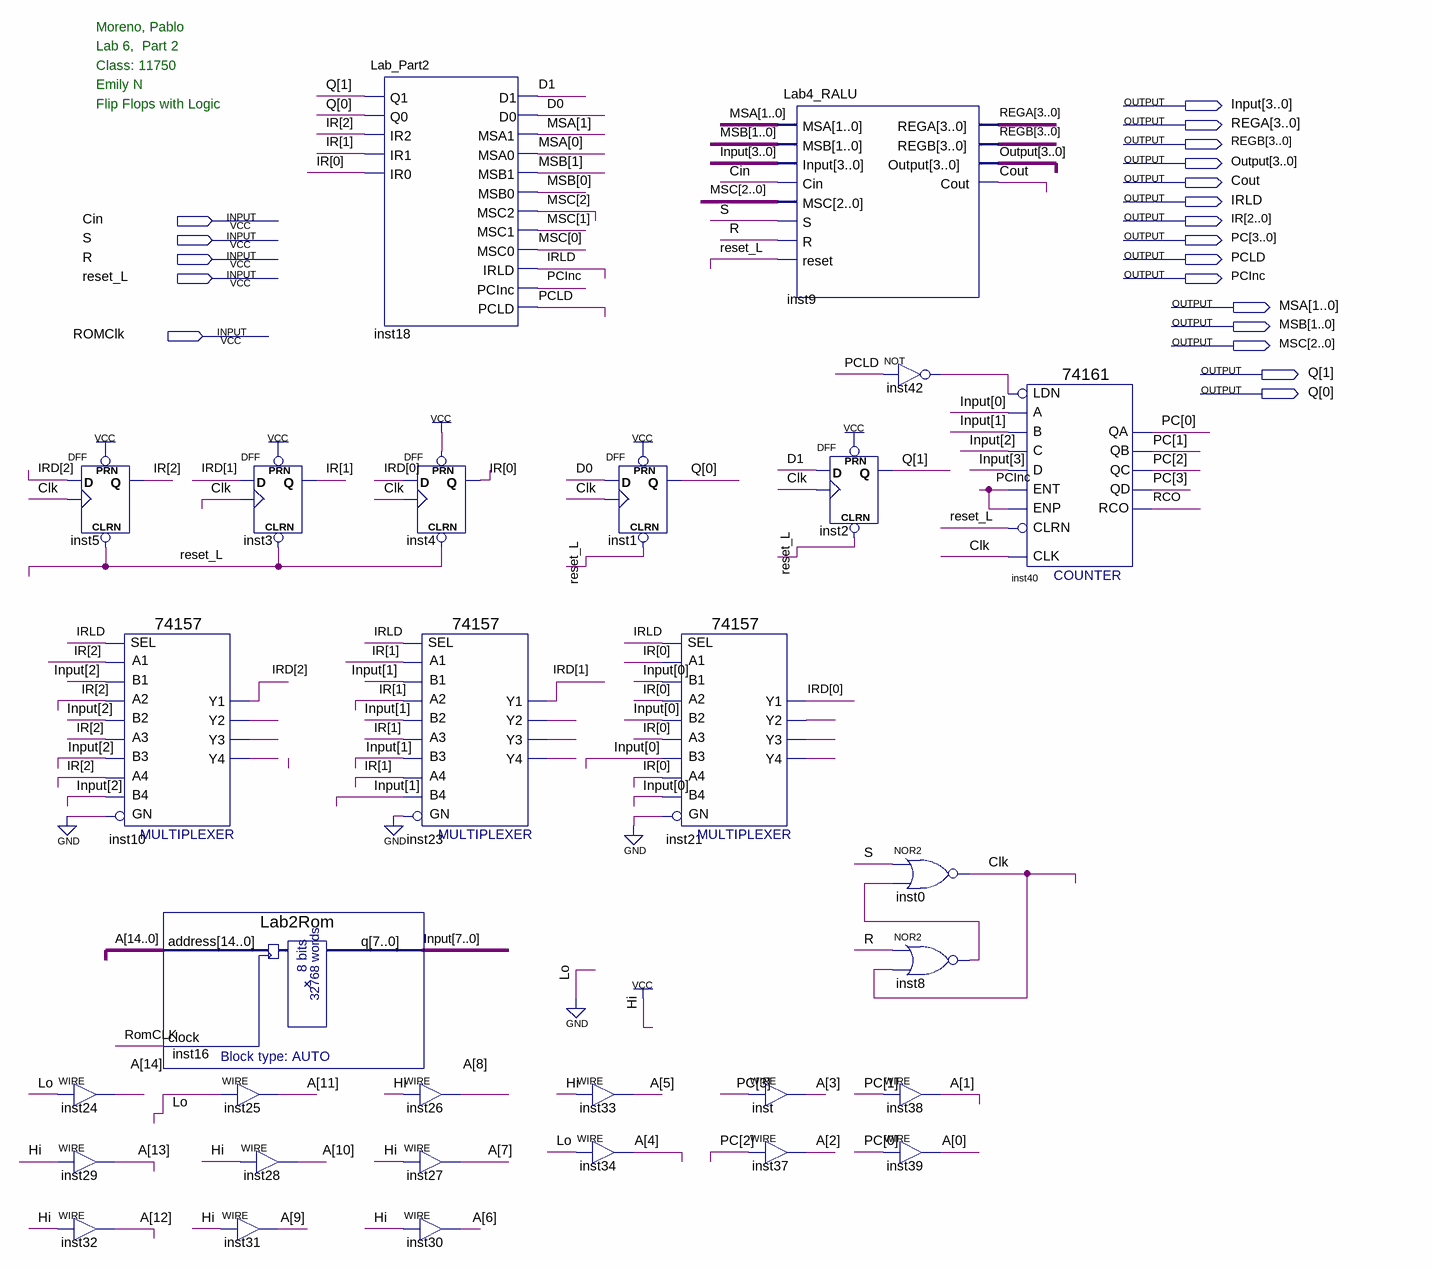
[diagram p0: schematic sheet]
// Quartus schematic Block1.bdf as structural Verilog: 30 symbols, 20 pins
module Block1 (
  input  Cin,
  input  S,
  input  R,
  input  reset_L,
  input  ROMClk,
  output [7:0] Input,
  output [3:0] REGA,
  output [3:0] REGB,
  output [3:0] Output,
  output Cout,
  output IRLD,
  output [2:0] IR,
  output [3:0] PC,
  output PCLD,
  output PCInc,
  output [1:0] MSA,
  output [1:0] MSB,
  output [2:0] MSC,
  output [1:0] Q
);

  wire Clk, D0, D1, inst8_out, inst10_y2, inst10_y3, inst10_y4, inst21_y2, inst21_y3, inst21_y4, inst23_y2,
       inst23_y3, inst23_y4, inst42_out, RCO;
  wire [2:0] IRD;
  wire [14:0] A;

  assign A[14] = 1'b0;  // WIRE inst24
  assign A[13] = 1'b1;  // WIRE inst29
  assign A[12] = 1'b1;  // WIRE inst32
  DFF inst5 (.CLRN(reset_L), .CLK(Clk), .D(IRD[2]), .PRN(1'b1), .Q(IR[2]));
  \74157  inst10 (
    .A1(IR[2]), .B1(Input[2]), .SEL(IRLD), .B2(Input[2]), .A3(IR[2]), .B3(Input[2]), .A2(IR[2]),
    .B4(Input[2]), .GN(1'b0), .A4(IR[2]), .Y2(inst10_y2), .Y1(IRD[2]), .Y4(inst10_y4), .Y3(inst10_y3));
  Lab2Rom inst16 (.address(A), .clock(ROMClk), .q(Input));
  DFF inst3 (.CLRN(reset_L), .CLK(Clk), .D(IRD[1]), .PRN(1'b1), .Q(IR[1]));
  assign A[11] = 1'b0;  // WIRE inst25
  assign A[10] = 1'b1;  // WIRE inst28
  assign A[9] = 1'b1;  // WIRE inst31
  Lab_Part2 inst18 (
    .Q1(Q[1]), .Q0(Q[0]), .IR2(IR[2]), .IR1(IR[1]), .IR0(IR[0]), .D1(D1), .D0(D0), .MSA1(MSA[1]),
    .MSA0(MSA[0]), .MSB1(MSB[1]), .MSB0(MSB[0]), .MSC2(MSC[2]), .MSC1(MSC[1]), .MSC0(MSC[0]), .IRLD(IRLD),
    .PCInc(PCInc), .PCLD(PCLD));
  DFF inst4 (.CLRN(reset_L), .CLK(Clk), .D(IRD[0]), .PRN(1'b1), .Q(IR[0]));
  \74157  inst23 (
    .A1(IR[1]), .B1(Input[1]), .SEL(IRLD), .B2(Input[1]), .A3(IR[1]), .B3(Input[1]), .A2(IR[1]),
    .B4(Input[1]), .GN(1'b0), .A4(IR[1]), .Y2(inst23_y2), .Y1(IRD[1]), .Y4(inst23_y4), .Y3(inst23_y3));
  assign A[8] = 1'b1;  // WIRE inst26
  assign A[7] = 1'b1;  // WIRE inst27
  assign A[6] = 1'b1;  // WIRE inst30
  assign A[5] = 1'b1;  // WIRE inst33
  assign A[4] = 1'b0;  // WIRE inst34
  DFF inst1 (.CLRN(reset_L), .CLK(Clk), .D(D0), .PRN(1'b1), .Q(Q[0]));
  \74157  inst21 (
    .A1(IR[0]), .B1(Input[0]), .SEL(IRLD), .B2(Input[0]), .A3(IR[0]), .B3(Input[0]), .A2(IR[0]),
    .B4(Input[0]), .GN(1'b0), .A4(IR[0]), .Y2(inst21_y2), .Y1(IRD[0]), .Y4(inst21_y4), .Y3(inst21_y3));
  assign A[3] = PC[3];  // WIRE inst
  assign A[2] = PC[2];  // WIRE inst37
  Lab4_RALU inst9 (
    .MSA(MSA), .MSB(MSB), .Input(Input[3:0]), .Cin(Cin), .MSC(MSC), .S(S), .R(R), .reset(reset_L),
    .REGA(REGA), .REGB(REGB), .Output(Output), .Cout(Cout));
  DFF inst2 (.CLRN(reset_L), .CLK(Clk), .D(D1), .PRN(1'b1), .Q(Q[1]));
  not inst42 (inst42_out, PCLD);
  nor inst0 (Clk, S, inst8_out);
  nor inst8 (inst8_out, R, Clk);
  assign A[1] = PC[1];  // WIRE inst38
  assign A[0] = PC[0];  // WIRE inst39
  \74161  inst40 (
    .CLRN(reset_L), .CLK(Clk), .ENP(PCInc), .LDN(inst42_out), .A(Input[0]), .D(Input[3]), .ENT(PCInc),
    .B(Input[1]), .C(Input[2]), .QD(PC[3]), .QC(PC[2]), .QB(PC[1]), .QA(PC[0]), .RCO(RCO));

  // Notes on the sheet:
  //   Moreno, Pablo
  //   Lab 6,  Part 2
  //   Class: 11750
  //   Emily N
  //   Flip Flops with Logic
endmodule
